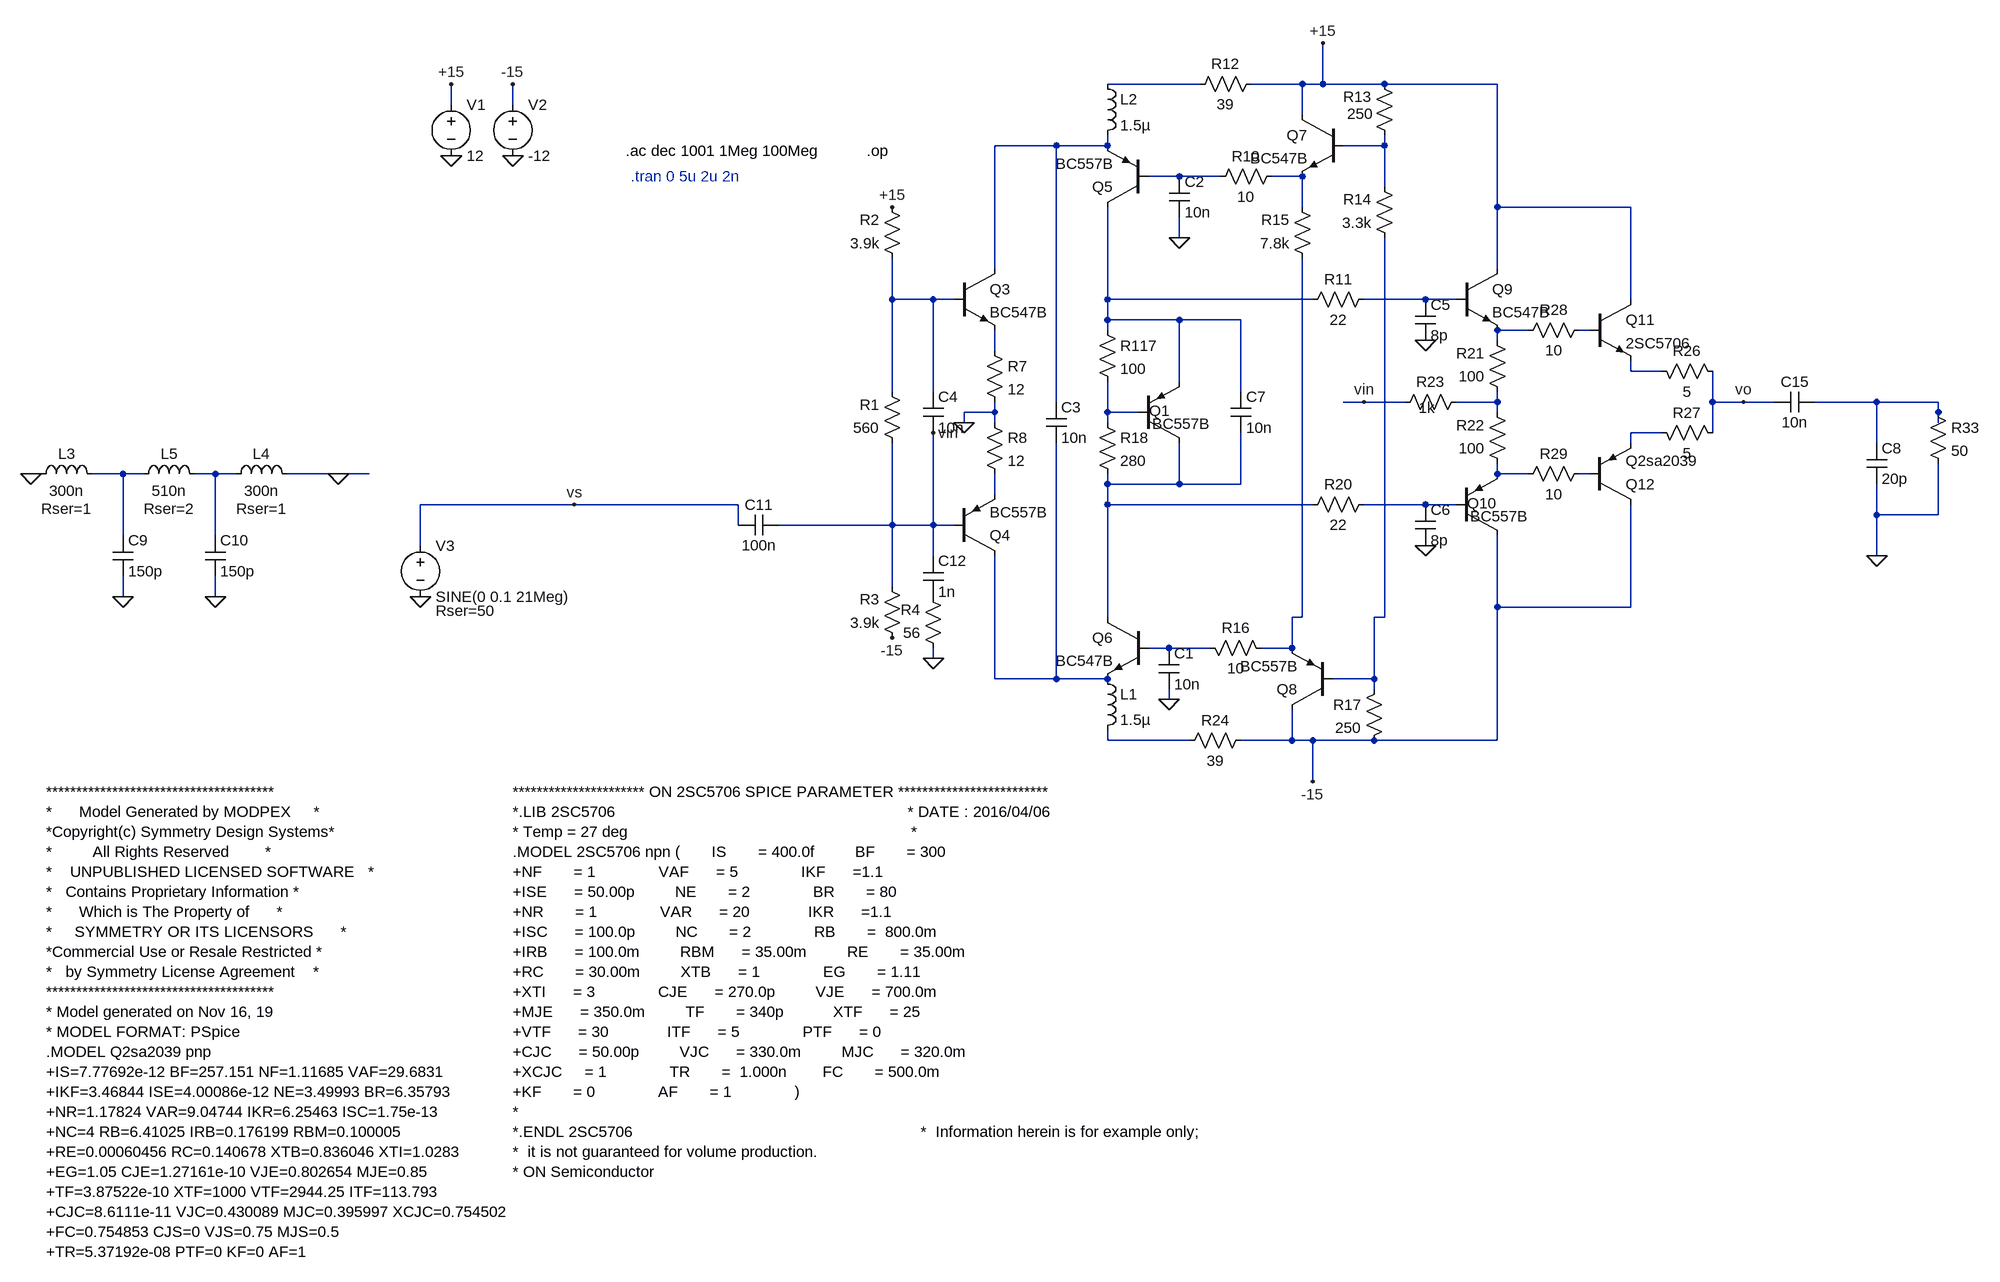
[diagram p0: schematic wideband_amp2.asc]
wideband_amp2.asc, the LTspice schematic file:
Version 4
SHEET 1 1864 1460
WIRE 640 -304 496 -304
WIRE 800 -304 720 -304
WIRE 832 -304 832 -368
WIRE 832 -304 800 -304
WIRE 928 -304 832 -304
WIRE 1104 -304 928 -304
WIRE -528 -272 -528 -304
WIRE -432 -272 -432 -304
WIRE 800 -256 800 -304
WIRE 416 -208 320 -208
WIRE 496 -208 496 -224
WIRE 496 -208 416 -208
WIRE 928 -208 928 -224
WIRE 928 -208 864 -208
WIRE 608 -160 560 -160
WIRE 672 -160 608 -160
WIRE 800 -160 752 -160
WIRE 928 -144 928 -208
WIRE 800 -112 800 -160
WIRE 1104 -112 1104 -304
WIRE 1312 -112 1104 -112
WIRE 608 -64 608 -96
WIRE 320 -16 320 -208
WIRE 1104 -16 1104 -112
WIRE 160 32 160 -32
WIRE 224 32 160 32
WIRE 256 32 224 32
WIRE 496 32 496 -112
WIRE 816 32 496 32
WIRE 992 32 896 32
WIRE 1040 32 992 32
WIRE 1312 32 1312 -112
WIRE 496 64 496 32
WIRE 608 64 496 64
WIRE 704 64 608 64
WIRE 496 80 496 64
WIRE 1152 80 1104 80
WIRE 1248 80 1232 80
WIRE 1104 96 1104 80
WIRE 320 112 320 80
WIRE 1312 144 1312 128
WIRE 1360 144 1312 144
WIRE 608 160 608 64
WIRE 160 176 160 32
WIRE 224 176 224 32
WIRE 704 176 704 64
WIRE 416 192 416 -208
WIRE 896 192 864 192
WIRE 960 192 896 192
WIRE 1104 192 1104 176
WIRE 1104 192 1040 192
WIRE 1440 192 1440 144
WIRE 1488 192 1440 192
WIRE 1536 192 1488 192
WIRE 1696 192 1600 192
WIRE 1792 192 1696 192
WIRE 320 208 320 192
WIRE 320 208 272 208
WIRE 496 208 496 160
WIRE 544 208 496 208
WIRE 1104 208 1104 192
WIRE 1792 208 1792 192
WIRE 272 224 272 208
WIRE 320 224 320 208
WIRE 496 224 496 208
WIRE 1792 224 1792 208
WIRE 1360 240 1312 240
WIRE 1440 240 1440 192
WIRE 1312 256 1312 240
WIRE 1696 256 1696 192
WIRE -1184 304 -1200 304
WIRE -1168 304 -1184 304
WIRE -1040 304 -1088 304
WIRE -1008 304 -1040 304
WIRE -896 304 -928 304
WIRE -864 304 -896 304
WIRE -704 304 -784 304
WIRE -656 304 -704 304
WIRE 1104 304 1104 288
WIRE 1152 304 1104 304
WIRE 1248 304 1232 304
WIRE 496 320 496 304
WIRE 608 320 608 256
WIRE 608 320 496 320
WIRE 704 320 704 240
WIRE 704 320 608 320
WIRE 320 336 320 304
WIRE -336 352 -576 352
WIRE -80 352 -336 352
WIRE 496 352 496 320
WIRE 816 352 496 352
WIRE 992 352 896 352
WIRE 1040 352 992 352
WIRE 1696 368 1696 320
WIRE 1792 368 1792 288
WIRE 1792 368 1696 368
WIRE -80 384 -80 352
WIRE 160 384 160 256
WIRE 160 384 -16 384
WIRE 224 384 224 240
WIRE 224 384 160 384
WIRE 256 384 224 384
WIRE -1040 400 -1040 304
WIRE -896 400 -896 304
WIRE -576 416 -576 352
WIRE 224 432 224 384
WIRE 1696 432 1696 368
WIRE 160 480 160 384
WIRE -1040 496 -1040 464
WIRE -896 496 -896 464
WIRE 1104 512 1104 400
WIRE 1312 512 1312 352
WIRE 1312 512 1104 512
WIRE 496 528 496 352
WIRE 800 528 800 -32
WIRE 800 528 784 528
WIRE 928 528 928 -64
WIRE 928 528 912 528
WIRE 592 576 560 576
WIRE 656 576 592 576
WIRE 784 576 784 528
WIRE 784 576 736 576
WIRE 224 592 224 576
WIRE 320 624 320 432
WIRE 416 624 416 256
WIRE 416 624 320 624
WIRE 496 624 416 624
WIRE 912 624 912 528
WIRE 912 624 848 624
WIRE 912 640 912 624
WIRE 592 656 592 640
WIRE 496 720 496 704
WIRE 624 720 496 720
WIRE 784 720 784 672
WIRE 784 720 704 720
WIRE 816 720 784 720
WIRE 912 720 816 720
WIRE 1104 720 1104 512
WIRE 1104 720 912 720
WIRE 816 784 816 720
FLAG -528 -192 0
FLAG -432 -192 0
FLAG -528 -304 +15
FLAG -432 -304 -15
FLAG 272 224 0
FLAG 592 656 0
FLAG 608 -64 0
FLAG 832 -368 +15
FLAG 816 784 -15
FLAG -576 496 0
FLAG 1696 432 0
FLAG -1040 496 0
FLAG -896 496 0
FLAG 1488 192 vo
FLAG 160 -112 +15
FLAG 160 560 -15
FLAG 224 240 vin
FLAG 992 416 0
FLAG 992 96 0
FLAG -336 352 vs
FLAG -1184 304 0
FLAG -704 304 0
FLAG 224 592 0
FLAG 896 192 vin
DATAFLAG 864 624 "$"
DATAFLAG 944 32 "$"
DATAFLAG 960 352 "$"
DATAFLAG 672 32 "$"
DATAFLAG 608 576 "$"
DATAFLAG 608 -160 "$"
DATAFLAG 512 720 "$"
DATAFLAG 560 -304 "$"
DATAFLAG 928 -208 "$"
DATAFLAG 704 352 "$"
DATAFLAG 224 32 "$"
DATAFLAG 208 384 "$"
SYMBOL voltage -528 -288 R0
SYMATTR InstName V1
SYMATTR Value 12
SYMATTR SpiceLine Rser=0
SYMBOL voltage -432 -288 R0
SYMATTR InstName V2
SYMATTR Value -12
SYMBOL npn 256 -16 R0
SYMATTR InstName Q3
SYMATTR Value BC547B
SYMBOL pnp 256 432 M180
SYMATTR InstName Q4
SYMATTR Value BC557B
SYMBOL res 304 96 R0
SYMATTR InstName R7
SYMATTR Value 12
SYMBOL res 304 208 R0
SYMATTR InstName R8
SYMATTR Value 12
SYMBOL pnp 560 -112 R180
SYMATTR InstName Q5
SYMATTR Value BC557B
SYMBOL npn 560 528 M0
SYMATTR InstName Q6
SYMATTR Value BC547B
SYMBOL res 480 64 R0
SYMATTR InstName R117
SYMATTR Value 100
SYMBOL cap 576 576 R0
SYMATTR InstName C1
SYMATTR Value 10n
SYMBOL cap 592 -160 R0
SYMATTR InstName C2
SYMATTR Value 10n
SYMBOL res 768 -176 R90
WINDOW 0 0 56 VBottom 2
WINDOW 3 32 56 VTop 2
SYMATTR InstName R10
SYMATTR Value 10
SYMBOL npn 864 -256 M0
SYMATTR InstName Q7
SYMATTR Value BC547B
SYMBOL res 736 -320 R90
WINDOW 0 0 56 VBottom 2
WINDOW 3 32 56 VTop 2
SYMATTR InstName R12
SYMATTR Value 39
SYMBOL res 944 -208 R180
WINDOW 0 36 76 Left 2
WINDOW 3 34 50 Left 2
SYMATTR InstName R13
SYMATTR Value 250
SYMBOL res 944 -48 R180
WINDOW 0 36 76 Left 2
WINDOW 3 36 40 Left 2
SYMATTR InstName R14
SYMATTR Value 3.3k
SYMBOL res 816 -16 R180
WINDOW 0 36 76 Left 2
WINDOW 3 36 40 Left 2
SYMATTR InstName R15
SYMATTR Value 7.8k
SYMBOL res 752 592 M270
WINDOW 0 32 56 VTop 2
WINDOW 3 0 56 VBottom 2
SYMATTR InstName R16
SYMATTR Value 10
SYMBOL res 928 624 M0
SYMATTR InstName R17
SYMATTR Value 250
SYMBOL pnp 848 672 R180
SYMATTR InstName Q8
SYMATTR Value BC557B
SYMBOL voltage -576 400 R0
WINDOW 39 24 118 Left 2
SYMATTR SpiceLine Rser=50
SYMATTR InstName V3
SYMATTR Value SINE(0 0.1 21Meg)
SYMATTR Value2 AC 1 0
SYMBOL npn 1040 -16 R0
SYMATTR InstName Q9
SYMATTR Value BC547B
SYMBOL pnp 1040 400 M180
WINDOW 0 17 50 Left 2
WINDOW 3 22 30 Left 2
SYMATTR InstName Q10
SYMATTR Value BC557B
SYMBOL res 912 16 R90
WINDOW 0 0 56 VBottom 2
WINDOW 3 32 56 VTop 2
SYMATTR InstName R11
SYMATTR Value 22
SYMBOL res 912 336 R90
WINDOW 0 0 56 VBottom 2
WINDOW 3 32 56 VTop 2
SYMATTR InstName R20
SYMATTR Value 22
SYMBOL res 1120 192 R180
WINDOW 0 36 76 Left 2
WINDOW 3 36 40 Left 2
SYMATTR InstName R21
SYMATTR Value 100
SYMBOL res 1120 304 R180
WINDOW 0 36 76 Left 2
WINDOW 3 36 40 Left 2
SYMATTR InstName R22
SYMATTR Value 100
SYMBOL cap 400 192 R0
SYMATTR InstName C3
SYMATTR Value 10n
SYMBOL res 1056 176 R90
WINDOW 0 0 56 VBottom 2
WINDOW 3 9 62 VTop 2
SYMATTR InstName R23
SYMATTR Value 1k
SYMBOL res 720 704 R90
WINDOW 0 0 56 VBottom 2
WINDOW 3 32 56 VTop 2
SYMATTR InstName R24
SYMATTR Value 39
SYMBOL ind 480 608 R0
SYMATTR InstName L1
SYMATTR Value 1.5µ
SYMATTR SpiceLine Rser=4
SYMBOL ind 480 -320 R0
SYMATTR InstName L2
SYMATTR Value 1.5µ
SYMATTR SpiceLine Rser=4
SYMBOL npn 1248 32 R0
SYMATTR InstName Q11
SYMATTR Value 2SC5706
SYMBOL pnp 1248 352 M180
SYMATTR InstName Q12
SYMATTR Value Q2sa2039
SYMBOL res 1344 128 M90
WINDOW 0 0 56 VBottom 2
WINDOW 3 32 56 VTop 2
SYMATTR InstName R26
SYMATTR Value 5
SYMBOL res 1344 224 M90
WINDOW 0 0 56 VBottom 2
WINDOW 3 32 56 VTop 2
SYMATTR InstName R27
SYMATTR Value 5
SYMBOL res 1248 64 R90
WINDOW 0 0 56 VBottom 2
WINDOW 3 32 56 VTop 2
SYMATTR InstName R28
SYMATTR Value 10
SYMBOL res 1248 288 R90
WINDOW 0 0 56 VBottom 2
WINDOW 3 32 56 VTop 2
SYMATTR InstName R29
SYMATTR Value 10
SYMBOL res 480 208 R0
SYMATTR InstName R18
SYMATTR Value 280
SYMBOL cap 688 176 R0
SYMATTR InstName C7
SYMATTR Value 10n
SYMBOL ind -1184 320 R270
WINDOW 0 32 56 VTop 2
WINDOW 3 5 56 VBottom 2
WINDOW 39 -23 56 VBottom 2
SYMATTR InstName L3
SYMATTR Value 300n
SYMATTR SpiceLine Rser=1
SYMBOL ind -880 320 R270
WINDOW 0 32 56 VTop 2
WINDOW 3 5 56 VBottom 2
WINDOW 39 -23 56 VBottom 2
SYMATTR InstName L4
SYMATTR Value 300n
SYMATTR SpiceLine Rser=1
SYMBOL ind -1024 320 R270
WINDOW 0 32 56 VTop 2
WINDOW 3 5 56 VBottom 2
WINDOW 39 -23 56 VBottom 2
SYMATTR InstName L5
SYMATTR Value 510n
SYMATTR SpiceLine Rser=2
SYMBOL cap -1056 400 R0
SYMATTR InstName C9
SYMATTR Value 150p
SYMBOL cap -912 400 R0
SYMATTR InstName C10
SYMATTR Value 150p
SYMBOL res 176 272 R180
WINDOW 0 36 76 Left 2
WINDOW 3 36 40 Left 2
SYMATTR InstName R1
SYMATTR Value 560
SYMBOL res 176 -16 R180
WINDOW 0 36 76 Left 2
WINDOW 3 36 40 Left 2
SYMATTR InstName R2
SYMATTR Value 3.9k
SYMBOL res 176 576 R180
WINDOW 0 36 76 Left 2
WINDOW 3 36 40 Left 2
SYMATTR InstName R3
SYMATTR Value 3.9k
SYMBOL cap 208 176 R0
SYMATTR InstName C4
SYMATTR Value 10n
SYMBOL cap -16 368 R90
WINDOW 0 0 32 VBottom 2
WINDOW 3 32 32 VTop 2
SYMATTR InstName C11
SYMATTR Value 100n
SYMBOL cap 1600 176 R90
WINDOW 0 0 32 VBottom 2
WINDOW 3 32 32 VTop 2
SYMATTR InstName C15
SYMATTR Value 10n
SYMBOL pnp 544 256 M180
WINDOW 0 17 50 Left 2
WINDOW 3 22 30 Left 2
SYMATTR InstName Q1
SYMATTR Value BC557B
SYMBOL res 1776 192 R0
SYMATTR InstName R33
SYMATTR Value 50
SYMBOL cap 1680 256 R0
SYMATTR InstName C8
SYMATTR Value 20p
SYMBOL cap 976 32 R0
SYMATTR InstName C5
SYMATTR Value 8p
SYMBOL cap 976 352 R0
SYMATTR InstName C6
SYMATTR Value 8p
SYMBOL res 240 592 R180
WINDOW 0 36 76 Left 2
WINDOW 3 36 40 Left 2
SYMATTR InstName R4
SYMATTR Value 56
SYMBOL cap 208 432 R0
SYMATTR InstName C12
SYMATTR Value 1n
TEXT -256 -200 Left 2 !.ac dec 1001 1Meg 100Meg
TEXT -248 -160 Left 2 ;.tran 0 5u 2u 2n
TEXT 120 -200 Left 2 !.op
TEXT -1160 800 Left 2 !**************************************\n*      Model Generated by MODPEX     *\n*Copyright(c) Symmetry Design Systems*\n*         All Rights Reserved        *\n*    UNPUBLISHED LICENSED SOFTWARE   *\n*   Contains Proprietary Information *\n*      Which is The Property of      *\n*     SYMMETRY OR ITS LICENSORS      *\n*Commercial Use or Resale Restricted *\n*   by Symmetry License Agreement    *\n**************************************\n* Model generated on Nov 16, 19\n* MODEL FORMAT: PSpice\n.MODEL Q2sa2039 pnp\n+IS=7.77692e-12 BF=257.151 NF=1.11685 VAF=29.6831\n+IKF=3.46844 ISE=4.00086e-12 NE=3.49993 BR=6.35793\n+NR=1.17824 VAR=9.04744 IKR=6.25463 ISC=1.75e-13\n+NC=4 RB=6.41025 IRB=0.176199 RBM=0.100005\n+RE=0.00060456 RC=0.140678 XTB=0.836046 XTI=1.0283\n+EG=1.05 CJE=1.27161e-10 VJE=0.802654 MJE=0.85\n+TF=3.87522e-10 XTF=1000 VTF=2944.25 ITF=113.793\n+CJC=8.6111e-11 VJC=0.430089 MJC=0.395997 XCJC=0.754502\n+FC=0.754853 CJS=0 VJS=0.75 MJS=0.5\n+TR=5.37192e-08 PTF=0 KF=0 AF=1
TEXT -432 800 Left 2 !********************** ON 2SC5706 SPICE PARAMETER *************************\n*.LIB 2SC5706                                                                 * DATE : 2016/04/06                                                           \n* Temp = 27 deg                                                               *                                                                             \n.MODEL 2SC5706 npn (       IS       = 400.0f         BF       = 300           \n+NF       = 1              VAF      = 5              IKF      =1.1            \n+ISE      = 50.00p         NE       = 2              BR       = 80            \n+NR       = 1              VAR      = 20             IKR      =1.1            \n+ISC      = 100.0p         NC       = 2              RB       =  800.0m       \n+IRB      = 100.0m         RBM      = 35.00m         RE       = 35.00m        \n+RC       = 30.00m         XTB      = 1              EG       = 1.11          \n+XTI      = 3              CJE      = 270.0p         VJE      = 700.0m        \n+MJE      = 350.0m         TF       = 340p           XTF      = 25            \n+VTF      = 30             ITF      = 5              PTF      = 0             \n+CJC      = 50.00p         VJC      = 330.0m         MJC      = 320.0m        \n+XCJC     = 1              TR       =  1.000n        FC       = 500.0m        \n+KF       = 0              AF       = 1              )                        \n*                                                                             \n*.ENDL 2SC5706                                                                *  Information herein is for example only;                                    \n*  it is not guaranteed for volume production.                                \n* ON Semiconductor

The netlist it stands for:
* wideband_amp2.asc
V1 +15 0 12 Rser=0
V2 -15 0 -12
Q3 N002 N006 N011 0 BC547B
Q4 N027 vin N022 0 BC557B
R7 N011 0 12
R8 0 N022 12
Q5 N007 N004 N002 0 BC557B
Q6 N021 N026 N027 0 BC547B
R117 N007 N015 100
C1 N026 0 10n
C2 N004 0 10n
R10 N005 N004 10
Q7 +15 N003 N005 0 BC547B
R12 +15 N001 39
R13 N003 +15 250
R14 N025 N003 3.3k
R15 N024 N005 7.8k
R16 N024 N026 10
R17 N025 -15 250
Q8 -15 N025 N024 0 BC557B
V3 vs 0 SINE(0 0.1 21Meg) AC 1 0 Rser=50
Q9 +15 N008 N009 0 BC547B
Q10 -15 N023 N019 0 BC557B
R11 N008 N007 22
R20 N023 N021 22
R21 N013 N009 100
R22 N019 N013 100
C3 N002 N027 10n
R23 N013 vin 1k
R24 -15 N028 39
L1 N027 N028 1.5µ Rser=4
L2 N001 N002 1.5µ Rser=4
Q11 +15 N010 N012 0 2SC5706
Q12 -15 N020 N016 0 Q2sa2039
R26 N012 vo 5
R27 N016 vo 5
R28 N010 N009 10
R29 N020 N019 10
R18 N015 N021 280
C7 N007 N021 10n
L3 0 N017 300n Rser=1
L4 N018 0 300n Rser=1
L5 N017 N018 510n Rser=2
C9 N017 0 150p
C10 N018 0 150p
R1 vin N006 560
R2 N006 +15 3.9k
R3 -15 vin 3.9k
C4 N006 vin 10n
C11 vin vs 100n
C15 N014 vo 10n
Q1 N021 N015 N007 0 BC557B
R33 N014 0 50
C8 N014 0 20p
C5 N008 0 8p
C6 N023 0 8p
R4 0 P001 56
C12 vin P001 1n
.model NPN NPN
.model PNP PNP
.lib standard.bjt
.ac dec 1001 1Meg 100Meg
* .tran 0 5u 2u 2n
.op
**************************************
*      Model Generated by MODPEX     *
*Copyright(c) Symmetry Design Systems*
*         All Rights Reserved        *
*    UNPUBLISHED LICENSED SOFTWARE   *
*   Contains Proprietary Information *
*      Which is The Property of      *
*     SYMMETRY OR ITS LICENSORS      *
*Commercial Use or Resale Restricted *
*   by Symmetry License Agreement    *
**************************************
* Model generated on Nov 16, 19
* MODEL FORMAT: PSpice
.MODEL Q2sa2039 pnp
+IS=7.77692e-12 BF=257.151 NF=1.11685 VAF=29.6831
+IKF=3.46844 ISE=4.00086e-12 NE=3.49993 BR=6.35793
+NR=1.17824 VAR=9.04744 IKR=6.25463 ISC=1.75e-13
+NC=4 RB=6.41025 IRB=0.176199 RBM=0.100005
+RE=0.00060456 RC=0.140678 XTB=0.836046 XTI=1.0283
+EG=1.05 CJE=1.27161e-10 VJE=0.802654 MJE=0.85
+TF=3.87522e-10 XTF=1000 VTF=2944.25 ITF=113.793
+CJC=8.6111e-11 VJC=0.430089 MJC=0.395997 XCJC=0.754502
+FC=0.754853 CJS=0 VJS=0.75 MJS=0.5
+TR=5.37192e-08 PTF=0 KF=0 AF=1
********************** ON 2SC5706 SPICE PARAMETER *************************
*.LIB 2SC5706                                                                 * DATE : 2016/04/06
* Temp = 27 deg                                                               *
.MODEL 2SC5706 npn (       IS       = 400.0f         BF       = 300
+NF       = 1              VAF      = 5              IKF      =1.1
+ISE      = 50.00p         NE       = 2              BR       = 80
+NR       = 1              VAR      = 20             IKR      =1.1
+ISC      = 100.0p         NC       = 2              RB       =  800.0m
+IRB      = 100.0m         RBM      = 35.00m         RE       = 35.00m
+RC       = 30.00m         XTB      = 1              EG       = 1.11
+XTI      = 3              CJE      = 270.0p         VJE      = 700.0m
+MJE      = 350.0m         TF       = 340p           XTF      = 25
+VTF      = 30             ITF      = 5              PTF      = 0
+CJC      = 50.00p         VJC      = 330.0m         MJC      = 320.0m
+XCJC     = 1              TR       =  1.000n        FC       = 500.0m
+KF       = 0              AF       = 1              )
*
*.ENDL 2SC5706                                                                *  Information herein is for example only;
*  it is not guaranteed for volume production.
* ON Semiconductor
.backanno
.end